# Altium schematic sheet LPCB235 - RM48 - GIO.SchDoc
size A3; Address1: Unit 4; DocumentNumber: 27; Revision: 2; SheetNumber: 27; SheetTotal: 37; Lockie__PCB_SUB_ASSEMBLY: GPIO; Lockie__PCB_ASSEMBLY: FCU PCB; Lockie__LDL: LPCB235; Lockie__PCB_DESCRIPTION: Flight Control Unit
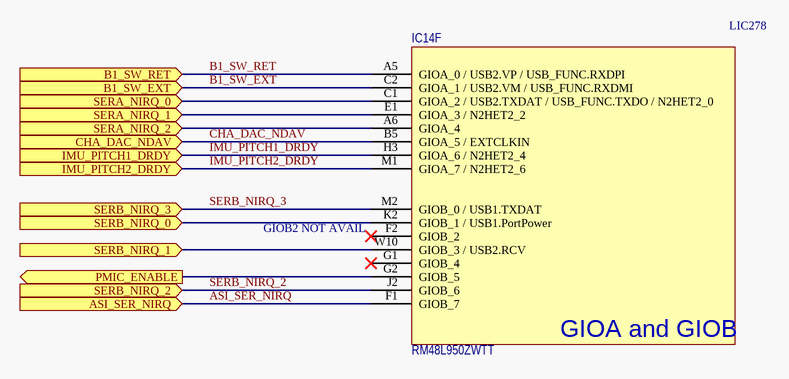
[diagram p0: LPCB235 - RM48 - GIO.SchDoc]

## Parts
IC14  RM48L950ZWTT  LDL_NUMBER: LIC278  [LFP054__ZWT (S-PBGA-N337)]  (part F of 10)

## Ports
ASI_SER_NIRQ (in), B1_SW_EXT (in), B1_SW_RET (in), CHA_DAC_NDAV (in), IMU_PITCH1_DRDY (in), IMU_PITCH2_DRDY (in), PMIC_ENABLE (out), SERA_NIRQ_0 (in), SERA_NIRQ_1 (in), SERA_NIRQ_2 (in), SERB_NIRQ_0 (in), SERB_NIRQ_1 (in), SERB_NIRQ_2 (in), SERB_NIRQ_3 (in)

## Nets
ASI_SER_NIRQ: IC14.F1(GIOB_7) ; port ASI_SER_NIRQ
B1_SW_EXT: IC14.C2(GIOA_1_/_USB2.VM_/_USB_FUNC.RXDMI) ; port B1_SW_EXT
B1_SW_RET: IC14.A5(GIOA_0_/_USB2.VP_/_USB_FUNC.RXDPI) ; port B1_SW_RET
CHA_DAC_NDAV: IC14.B5(GIOA_5_/_EXTCLKIN) ; port CHA_DAC_NDAV
IMU_PITCH1_DRDY: IC14.H3(GIOA_6_/_N2HET2_4) ; port IMU_PITCH1_DRDY
IMU_PITCH2_DRDY: IC14.M1(GIOA_7_/_N2HET2_6) ; port IMU_PITCH2_DRDY
PMIC_ENABLE: IC14.G2(GIOB_5) ; port PMIC_ENABLE
SERA_NIRQ_0: IC14.C1(GIOA_2_/_USB2.TXDAT_/_USB_FUNC.TXDO_/_N2HET2_0) ; port SERA_NIRQ_0
SERA_NIRQ_1: IC14.E1(GIOA_3_/_N2HET2_2) ; port SERA_NIRQ_1
SERA_NIRQ_2: IC14.A6(GIOA_4) ; port SERA_NIRQ_2
SERB_NIRQ_0: IC14.K2(GIOB_1_/_USB1.PortPower) ; port SERB_NIRQ_0
SERB_NIRQ_1: IC14.W10(GIOB_3_/_USB2.RCV) ; port SERB_NIRQ_1
SERB_NIRQ_2: IC14.J2(GIOB_6) ; port SERB_NIRQ_2
SERB_NIRQ_3: IC14.M2(GIOB_0_/_USB1.TXDAT) ; port SERB_NIRQ_3

Not connected (* = marked no-connect by the designer): IC14 F2(GIOB_2)* G1(GIOB_4)*

## Notes on the sheet
- GIOB2 NOT AVAIL
- PCB COMPONENT DESCRIPTION
- LDL NUMBER
- Assembly Details
- Size
- Drawing File Name
- Revision
- http://rloop.org
- Scale
- A3
- Sheet Details
- N.T.S
- Sheet:
- Of:
- (in symbol RM48L950ZWTT, part F) GIOA and GIOB

## Library data of the parts
IC14 = RM48L950ZWTT: IC, CPU, RM48 Safety CPU, SMD NFBGA337 [LIC278]; FMEDA__FUNCTION_IN_SYSTEM: SAFETY CPU 1; FMEDA__OPERATING__TEMP_MIN: -20; FMEDA__OPERATING__TEMP_TYP: 27; FMEDA__OPERATING__TEMP_MAX: 50; FMEDA__CHANNEL: COM